# EAGLE design teensy-can (EAGLE 9.6.1)
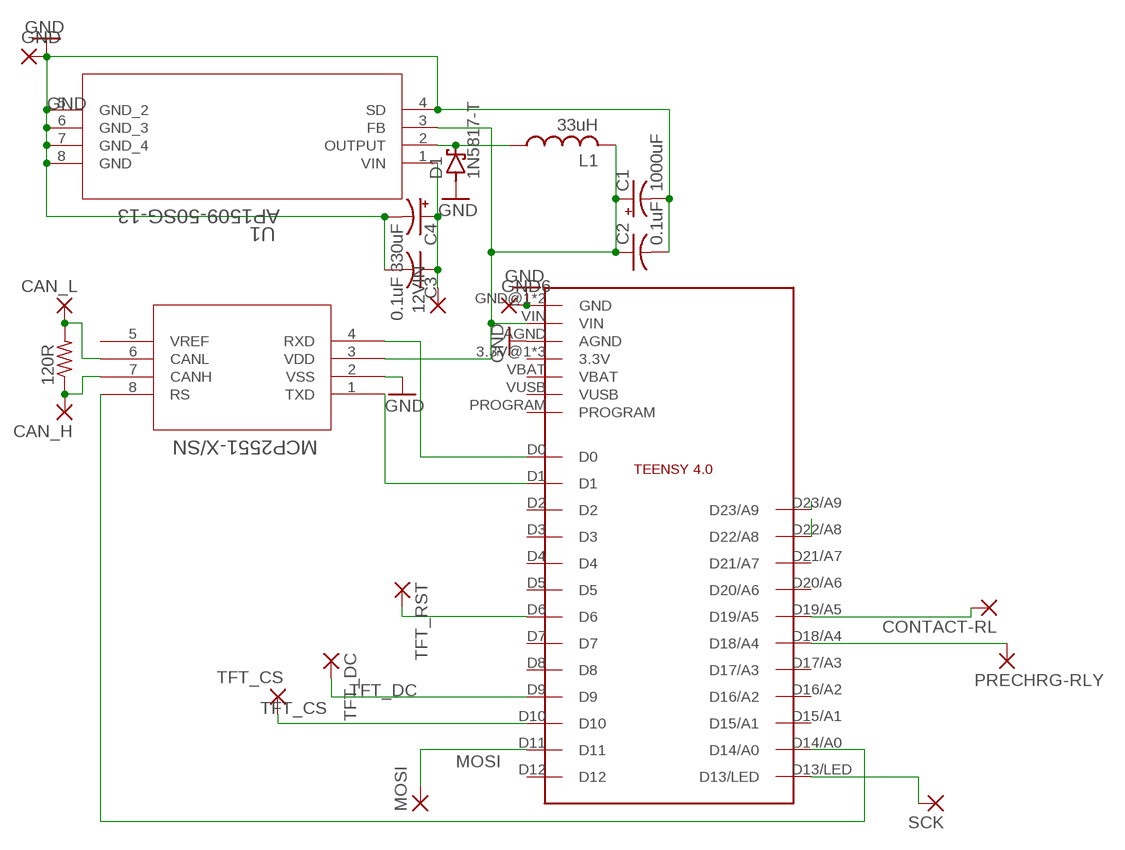
[diagram p0: schematic, sheet 1]

## Parts
12VIN  1,6/0,8  [1,6/0,8]
120R  R-US_R0805  [R0805]
C1  1000uF  CPOL-USE5-10.5  [E5-10,5]
C2  0.1uF  C-USC0402  [C0402]
C3  0.1uF  C-USC0402  [C0402]
C4  330uF  CPOL-USE3.5-8  [E3,5-8]
CAN_H  1,6/0,8  [1,6/0,8]
CAN_L  1,6/0,8  [1,6/0,8]
CONTACT-RL  1,6/0,8  [1,6/0,8]
D1  1N5817-T  [DO41-7.6]
GND  1,6/0,8  [1,6/0,8]
GND6  1,6/0,8  [1,6/0,8]
L1  33uH  L-USL2012C  [L2012C]
MOSI  1,6/0,8  [1,6/0,8]
PRECHRG-RLY  1,6/0,8  [1,6/0,8]
SCK  1,6/0,8  [1,6/0,8]
TFT_CS  1,6/0,8  [1,6/0,8]
TFT_DC  1,6/0,8  [1,6/0,8]
TFT_RST  1,6/0,8  [1,6/0,8]
U1  AP1509-50SG-13  [SOP-8L_DIO]
U$1  MCP2551-X/SN  [SOIC8-N_MC]
U$2  TEENSY4.0  [TEENSY4.0]

## Nets
5VIN: C1.+ C2.1 L1.2 U1.3(FB) U$1.3(VDD) U$2.VIN
12VIN: 12VIN.1(P) C3.1 C4.+ U1.1(VIN)
CANRX: U$1.4(RXD) U$2.D0
CANTX: U$1.1(TXD) U$2.D1
GND: C1.- C2.2 C3.2 C4.- D1.A GND6.1(P) GND.1(P) U1.4(SD) U1.5(GND_2) U1.6(GND_3) U1.7(GND_4) U1.8(GND) U$1.2(VSS) U$2.AGND U$2.GND@1(GND) U$2.GND@2(GND)
MOSI: MOSI.1(P) U$2.D11
N$1: PRECHRG-RLY.1(P) U$2.D18/A4
N$2: CONTACT-RL.1(P) U$2.D19/A5
N$3: TFT_RST.1(P) U$2.D6
N$4: U$1.8(RS) U$2.D14/A0
N$5: 120R.1 CAN_H.1(P) U$1.7(CANH)
N$6: 120R.2 CAN_L.1(P) U$1.6(CANL)
N$7: U$2.D22/A8
N$8: U$2.D23/A9
N$9: SCK.1(P) U$2.D13/LED
OUTPUT: D1.C L1.1 U1.2(OUTPUT)
TFT_CS: TFT_CS.1(P) U$2.D10
TFT_DC: TFT_DC.1(P) U$2.D9
Unconnected: U$1.5(VREF) U$2.3.3V@1(3.3V) U$2.3.3V@2(3.3V) U$2.D2 U$2.D3 U$2.D4 U$2.D5 U$2.D7 U$2.D8 U$2.D12 U$2.D15/A1 U$2.D16/A2 U$2.D17/A3 U$2.D20/A6 U$2.D21/A7 U$2.ON/OFF(3.3V) U$2.PROGRAM U$2.VBAT U$2.VUSB

## Library data of the parts
12VIN CAN_H CAN_L CONTACT-RL GND GND6 MOSI PRECHRG-RLY SCK TFT_CS TFT_DC TFT_RST = wirepad:1,6/0,8: THROUGH-HOLE PAD
120R = adafruit:R-US_: RESISTOR, American symbol
C1 C4 = rcl:CPOL-US: POLARIZED CAPACITOR, American symbol; SPICEPREFIX: C
C2 C3 = rcl:C-US: CAPACITOR, American symbol; SPICEPREFIX: C
D1 = diode:1N581*: 1.0A SCHOTTKY BARRIER RECTIFIER Source: http://www.diodes.com/datasheets/ds23001.pdf
L1 = rcl:L-US: INDUCTOR, American symbol; SPICEPREFIX: L
U1 = AP150950SG13:AP1509-50SG-13; BUILT_BY: EMA_UL_Team; MANUFACTURER_PART_NUMBER: AP1509-50SG-13; SOURCELIBRARY: DIODESINC_2_2015-08-18; VENDOR: Diodes Inc
U$1 = MCP2515:MCP2551-X/SN
U$2 = Teensy4.0:TEENSY4.0

## Board
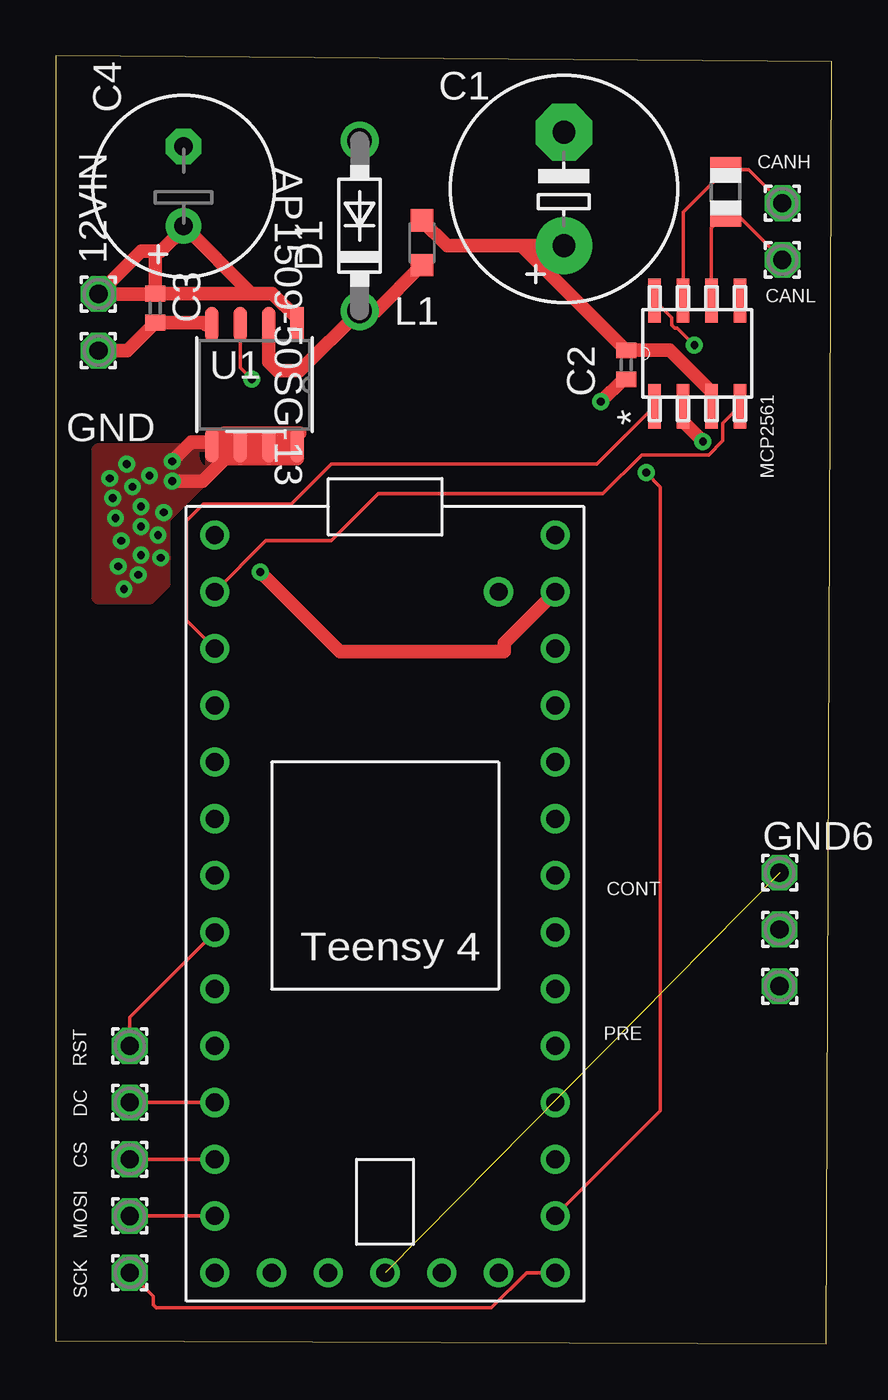
[diagram p1: board, top side]
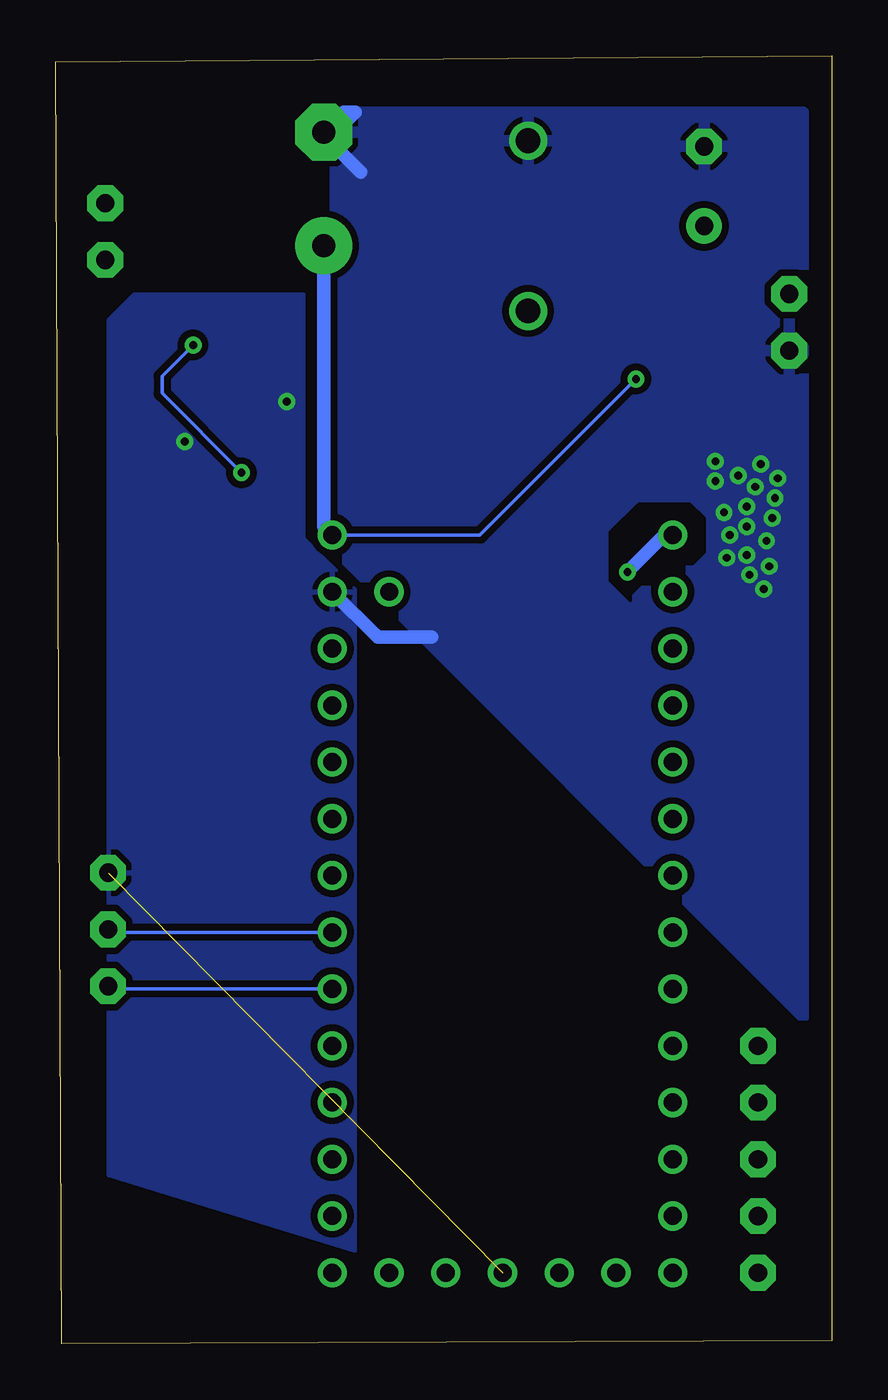
[diagram p2: board, bottom side, seen from below]

Size 34.72 x 57.65 mm. Coordinates in mm from the lower left corner, seen from the top.
Outline: 0,0.13 34.47,0 34.72,57.39 0,57.65 0,0.13
Copper layers (1*16): Top 0.035mm / dielectric 1.5mm / Bottom 0.035mm
Design rules "default": minimum track width 6mil, minimum drill 0.35mm, track to track 6mil, track to pad 6mil, pad to pad 6mil, via to via 6mil, smd to smd 6mil, copper to edge 40mil, drill to drill 6mil, minimum pad ring 10mil, minimum via ring 8mil, stop-mask expansion 4mil, vias tented up to drill 0mil, thermal gap 10mil

### Footprints (pad centres in the part's own frame; a part is rotated, then mirrored left to right if it is on the bottom)
1,6/0,8 = drill 0.813 pad 1.6 octagon: 1 0,0
R0805 = smd 1.1 x 1.4: 1 -1,0; 2 1,0
E5-10,5 = drill 1.016 pad 2.54: + -2.54,0 | drill 1.016 pad 2.54 octagon: - 2.54,0
C0402 = smd 0.7 x 0.9: 1 -0.65,0; 2 0.65,0
E3,5-8 = drill 0.813 pad 1.6: + -1.778,0 | drill 0.813 pad 1.6 octagon: - 1.778,0
DO41-7.6 = drill 1.1 pad 1.7: A 3.81,0; C -3.81,0
L2012C = smd 1 x 1: 1 -1,0; 2 1,0
SOP-8L_DIO = smd 1.55 x 0.6: 1 -2.7,1.905; 2 -2.7,0.635; 3 -2.7,-0.635; 4 -2.7,-1.905; 5 2.7,-1.905; 6 2.7,-0.635; 7 2.7,0.635; 8 2.7,1.905
SOIC8-N_MC = smd 1.981 x 0.559: 1 -2.362,1.905; 2 -2.362,0.635; 3 -2.362,-0.635; 4 -2.362,-1.905; 5 2.362,-1.905; 6 2.362,-0.635; 7 2.362,0.635; 8 2.362,1.905
TEENSY4.0 = drill 0.8: 3.3V@1 7.62,10.16; 3.3V@2 -2.54,-17.78; AGND 7.62,12.7; D0 -7.62,12.7; D1 -7.62,10.16; D2 -7.62,7.62; D3 -7.62,5.08; D4 -7.62,2.54; D5 -7.62,0; D6 -7.62,-2.54; D7 -7.62,-5.08; D8 -7.62,-7.62; D9 -7.62,-10.16; D10 -7.62,-12.7; D11 -7.62,-15.24; D12 -7.62,-17.78; D13/LED 7.62,-17.78; D14/A0 7.62,-15.24; D15/A1 7.62,-12.7; D16/A2 7.62,-10.16; D17/A3 7.62,-7.62; D18/A4 7.62,-5.08; D19/A5 7.62,-2.54; D20/A6 7.62,0; D21/A7 7.62,2.54; D22/A8 7.62,5.08; D23/A9 7.62,7.62; GND@1 -7.62,15.24; GND@2 0,-17.78; ON/OFF 5.08,-17.78; PROGRAM 2.54,-17.78; VBAT -5.08,-17.78; VIN 7.62,15.24; VUSB 5.08,12.7

### Placement (x,y rotation side)
12VIN  1.91,46.99 180 top
120R  29.97,51.56 270 top
C1  22.73,51.69 90 top
C2  25.53,43.81 270 top
C3  4.45,46.35 270 top
C4  5.71,51.82 90 top
CAN_H  32.51,51.05 0 top
CAN_L  32.51,48.51 180 top
CONTACT-RL  32.38,18.54 0 top
D1  13.59,50.04 90 top
GND  1.91,44.45 180 top
GND6  32.38,21.08 0 top
L1  16.38,49.28 90 top
MOSI  3.3,5.71 0 top
PRECHRG-RLY  32.38,16 0 top
SCK  3.3,3.17 0 top
TFT_CS  3.3,8.25 0 top
TFT_DC  3.3,10.79 0 top
TFT_RST  3.3,13.33 0 top
U1  8.89,42.93 270 top
U$1  28.7,44.32 90 top
U$2  14.73,20.96 0 top

### Tracks (layer width: path | path; a pad name or v marks a point on that pad's centre or on a via)
5VIN  (via drill 0.35)
  Top 0.152: C2.1 25.46,44.51 | 29.34,42.34 U$1.3 | U1.3 8.26,43.69 v8.76,43.18
  Top 0.61: 25.46,44.51 20.83,49.15 C1.+ 17.51,49.15 L1.2 | 29.34,42.34 29.34,42.61 27.48,44.46 C2.1
  Bottom 0.152: v8.76,43.18 15.75,36.2 U$2.VIN
  Bottom 0.61: U$2.VIN 22.73,36.58 C1.+
12VIN
  Top 0.61: C3.1 4.45,48.89 | U1.1 10.79,45.9 9.69,47 8.75,47 | C3.1 4.43,46.99 12VIN.1 3.81,48.89 4.45,48.89 | 4.45,48.89 4.7,48.89 5.71,49.91 C4.+ 8.75,47 | C3.1 8.75,47
CANRX
  Top 0.152: U$1.4 29.85,41.2 29.85,40.42 29.21,39.78 26.21,39.78 24.48,38.05 14.43,38.05 12.32,35.94 9.4,35.94 U$2.D0
CANTX
  Top 0.152: U$2.D1 5.84,32.38 5.84,36.83 6.6,37.59 10.54,37.59 12.32,39.37 24.21,39.37 U$1.1
GND  (via drill 0.35)  (1 unrouted)
  Top 0.152: 28.89,40.45 v28.96,40.39
  Top 0.305: U1.6 8.26,39.62
  Top 0.61: v24.38,42.16 25.39,43.16 C2.2 | U$1.2 28.07,41.27 28.89,40.45 | U1.4 6.7,45.63 6.62,45.7 C3.2 3.19,44.45 GND.1 | v9.14,34.54 12.7,30.99 20.07,30.99 20.07,31.37 U$2.AGND | 8.13,40.35 U1.6 U1.5 | 9.14,40.61 U1.7 | U1.5 7.59,39.62 | 7.59,39.62 10.79,39.62 U1.8 U1.7 | 7.11,40.35 7.24,40.23 U1.7 | U1.5 7.11,40.35 | 7.11,40.35 7.53,40.77 10.92,40.77 | v5.21,39.5 6.06,40.35 7.11,40.35 | v5.21,38.61 6.57,38.61 7.59,39.62
  Bottom 0.61: U$2.AGND 20.32,31.62 17.91,31.62 | C1.- 21.84,55.12 21.34,55.12 22.23,54.23 C1.- | C1.- 22.73,54.1 21.08,52.45 | v9.14,34.54 7.49,36.2 U$2.GND@1
  other vias: 4.83,37.21 3.81,37.46 3.43,38.35 2.67,36.96 2.92,35.94 4.57,36.2 3.81,35.31 3.05,33.78 3.17,39.37 2.41,38.73 4.19,38.86 2.79,34.8 3.68,34.42 4.7,35.18 3.81,36.58 2.54,37.85
  pour Bottom: 3.43,2.41 2.79,3.05 2.54,3.05
  pour Bottom (isolate 0.305): 1.27,55.12 22.23,55.12 22.23,35.56 1.27,14.6
  pour Bottom (isolate 0.305): 23.62,46.99 31.24,46.99 32.38,45.85 32.38,7.54 21.34,4.13 21.34,33.78 23.62,36.07
  pour Top: 6.6,40 1.91,40 1.91,33.4 4.19,33.4 4.83,34.04 4.83,36.96 6.73,38.86 6.73,40.13
  cutout Bottom: 9.02,33.27 9.91,34.16 9.91,36.32 8.64,37.59 6.86,37.59 6.35,37.59 5.71,36.96 5.71,35.43 6.22,34.92 7.62,34.92 8.13,34.42 9.02,33.53
MOSI
  Top 0.152: U$2.D11 MOSI.1
N$1
  Bottom 0.152: U$2.D18/A4 32.26,15.88 PRECHRG-RLY.1
N$2
  Bottom 0.152: U$2.D19/A5 32.26,18.41 CONTACT-RL.1
N$3
  Top 0.152: U$2.D6 3.3,14.6 TFT_RST.1
N$4  (via drill 0.35)
  Top 0.152: U$1.8 27.56,45.92 27.56,45.6 27.69,45.47 27.81,45.47 v28.58,44.7 | v26.42,38.99 27.05,38.35 27.05,10.41 U$2.D14/A0
  Bottom 0.152: v28.58,44.7 29.97,43.31 29.97,42.54 v26.42,38.99
N$5
  Top 0.152: CAN_H.1 31,52.56 120R.1 28.07,50.66 U$1.7
N$6
  Top 0.152: CAN_L.1 30.46,50.56 120R.2 29.34,49.93 U$1.6
N$9
  Top 0.152: U$2.D13/LED 21.06,3.17 19.49,1.6 4.49,1.6 4.36,1.73 4.36,2.12 SCK.1
OUTPUT
  Top 0.61: U1.2 9.53,43.94 9.91,43.56 10.92,43.56 D1.C 14.33,46.23 L1.1
TFT_CS
  Top 0.152: U$2.D10 TFT_CS.1
TFT_DC
  Top 0.152: U$2.D9 TFT_DC.1

### Text on the board
tPlace: CANH | CANL | MCP2561 | CONT | RST | PRE | DC | CS | MOSI | SCK